# EAGLE schematic mptt-controller (EAGLE 7.5.0)
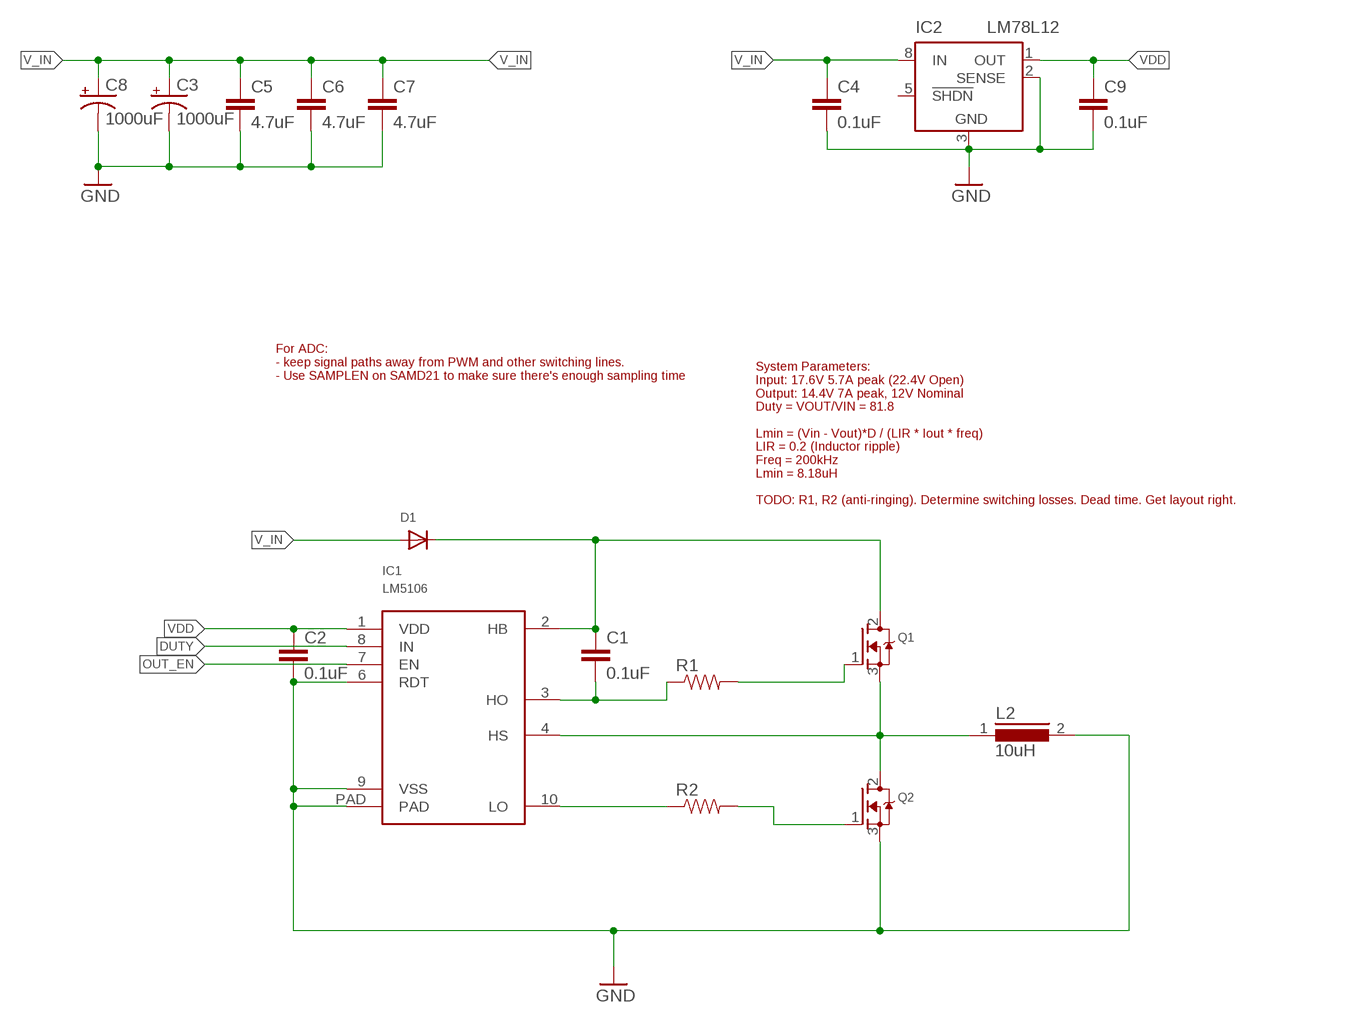
[diagram p0: schematic, sheet 1]

## Parts
C1  0.1uF  0.1UF-25V(+80/-20%)(0603)  [0603-CAP]
C2  0.1uF  0.1UF-25V(+80/-20%)(0603)  [0603-CAP]
C3  1000uF  CAP_POLPTH4  [CPOL-RADIAL-1000UF-25V]
C4  0.1uF  0.1UF-25V(+80/-20%)(0603)  [0603-CAP]
C5  4.7uF  0.1UF-25V(+80/-20%)(0603)  [0603-CAP]
C6  4.7uF  0.1UF-25V(+80/-20%)(0603)  [0603-CAP]
C7  4.7uF  0.1UF-25V(+80/-20%)(0603)  [0603-CAP]
C8  1000uF  CAP_POLPTH4  [CPOL-RADIAL-1000UF-25V]
C9  0.1uF  0.1UF-25V(+80/-20%)(0603)  [0603-CAP]
D1  DIODE_SOD-123FL  [SOD-123FL]
IC1  LM5106  [10WSON]
IC2  LM78L12  LT1963ES8  [SOIC8]
L2  10uH  SFT1040  [SFT1040]
Q1  MOSFET-NGDS_TO220V  [TO220V]
Q2  MOSFET-NGDS_TO220V  [TO220V]
R1  RESISTOR0603  [0603-RES]
R2  RESISTOR0603  [0603-RES]

## Nets
DUTY: IC1.8(IN)
GND: C2.2 C3.- C4.2 C5.2 C6.2 C7.2 C8.- C9.2 IC1.6(RDT) IC1.9(VSS) IC1.PAD IC2.2(SENSE) IC2.3(GND) L2.2 Q2.3(S)
N$1: IC1.4(HS) L2.1 Q1.3(S) Q2.2(D)
N$2: C1.2 IC1.3(HO) R1.1
N$3: Q1.1(G) R1.2
N$4: IC1.10(LO) R2.1
N$5: Q2.1(G) R2.2
N$6: C1.1 D1.C IC1.2(HB) Q1.2(D)
OUT_EN: IC1.7(EN)
V_IN: C3.+ C4.1 C5.1 C6.1 C7.1 C8.+ D1.A IC2.8(IN)
VDD: C2.1 C9.1 IC1.1(VDD) IC2.1(OUT)
Unconnected: IC2.4(NC) IC2.5(!SHDN)

## Notes on the sheet
- For ADC:
  - keep signal paths away from PWM and other switching lines.
  - Use SAMPLEN on SAMD21 to make sure there's enough sampling time
- System Parameters:
  Input: 17.6V 5.7A peak (22.4V Open)
  Output: 14.4V 7A peak, 12V Nominal 
  Duty = VOUT/VIN = 81.8
  
  Lmin = (Vin - Vout)*D / (LIR * Iout * freq)
  LIR = 0.2 (Inductor ripple)
  Freq = 200kHz
  Lmin = 8.18uH
  
  TODO: R1, R2 (anti-ringing). Determine switching losses. Dead time. Get layout right.

## Power pins joined to a net without a drawn wire
GND: IC2.6(GND) IC2.7(GND)

## Library data of the parts
C1 C2 C4 C9 = SparkFun-Capacitors:0.1UF-25V(+80/-20%)(0603): CAP-00810 Ceramic Standard decoupling cap; PROD_ID: CAP-00810
C3 C8 = SparkFun-Capacitors:CAP_POL: Capacitor Polarized These are standard SMD and PTH capacitors. Normally 10uF, 47uF, and 100uF in electrolytic and tantalum varieties. Always verify the external diameter of the through hole cap, it varies with capacity, voltage, and manufacturer. The EIA devices should be standard.
C5-C7 = SparkFun-Capacitors:0.1UF-25V(+80/-20%)(0603): CAP-00810 Ceramic Standard decoupling cap; PROD_ID: CAP-00810; VALUE: 0.1uF
D1 = adafruit:DIODE: Diode SMADIODE - SMA Surface Mount Package 20V 1A Schottky Diode Digikey: 641-1014-6-ND DO-1N4148 - Through Hole Small Current Diode SOD-123 20V 1 A (.5mV Vf) Schottky Diode - Digikey: MBRX120TPMSCT-ND SOD-323 10V 570mA (.38mV Vf, 3ns) Schottky Diode - Digikey: ZLLS410CT-ND SOD-523 30V 30mA Schottky Diode (RB751S-40TE61) - Digikey: RB751S-40TE61CT-ND SOT23-R/W - SOT23 Package (R = Solder Paste/Reflow Ovens, W = Hand-Soldering) BAT54Film 40V 300mA - Digikey: 497-7162-1-ND
IC1 = mosfet_drivers:LM5106
IC2 = linear-technology:LT1963ES8: 1.5A, Low Noise, Fast Transient Response LDO Regulator Source: http://www.linear.com/pc/downloadDocument.do?navId=H0,C3,P2222,D3148; MPN: LT1963ES8; OC_FARNELL: unknown; OC_NEWARK: 57M7550
L2 = inductors:SFT1040: INDUCTOR
Q1 Q2 = adafruit:MOSFET-N: N-Channel Mosfet 2N7002E - 60V 260mA SOT23 [Digikey: 2N7002ET1GOSTR-ND] - REEL BSH103 - 30V 850mA SOT23 [Digikey: 568-5013-1-ND]
R1 R2 = SparkFun-Resistors:RESISTOR: Resistor Basic schematic elements and footprints for 0603, 1206, and PTH resistors.